# Altium schematic sheet lw-skit.SchDoc
size A4
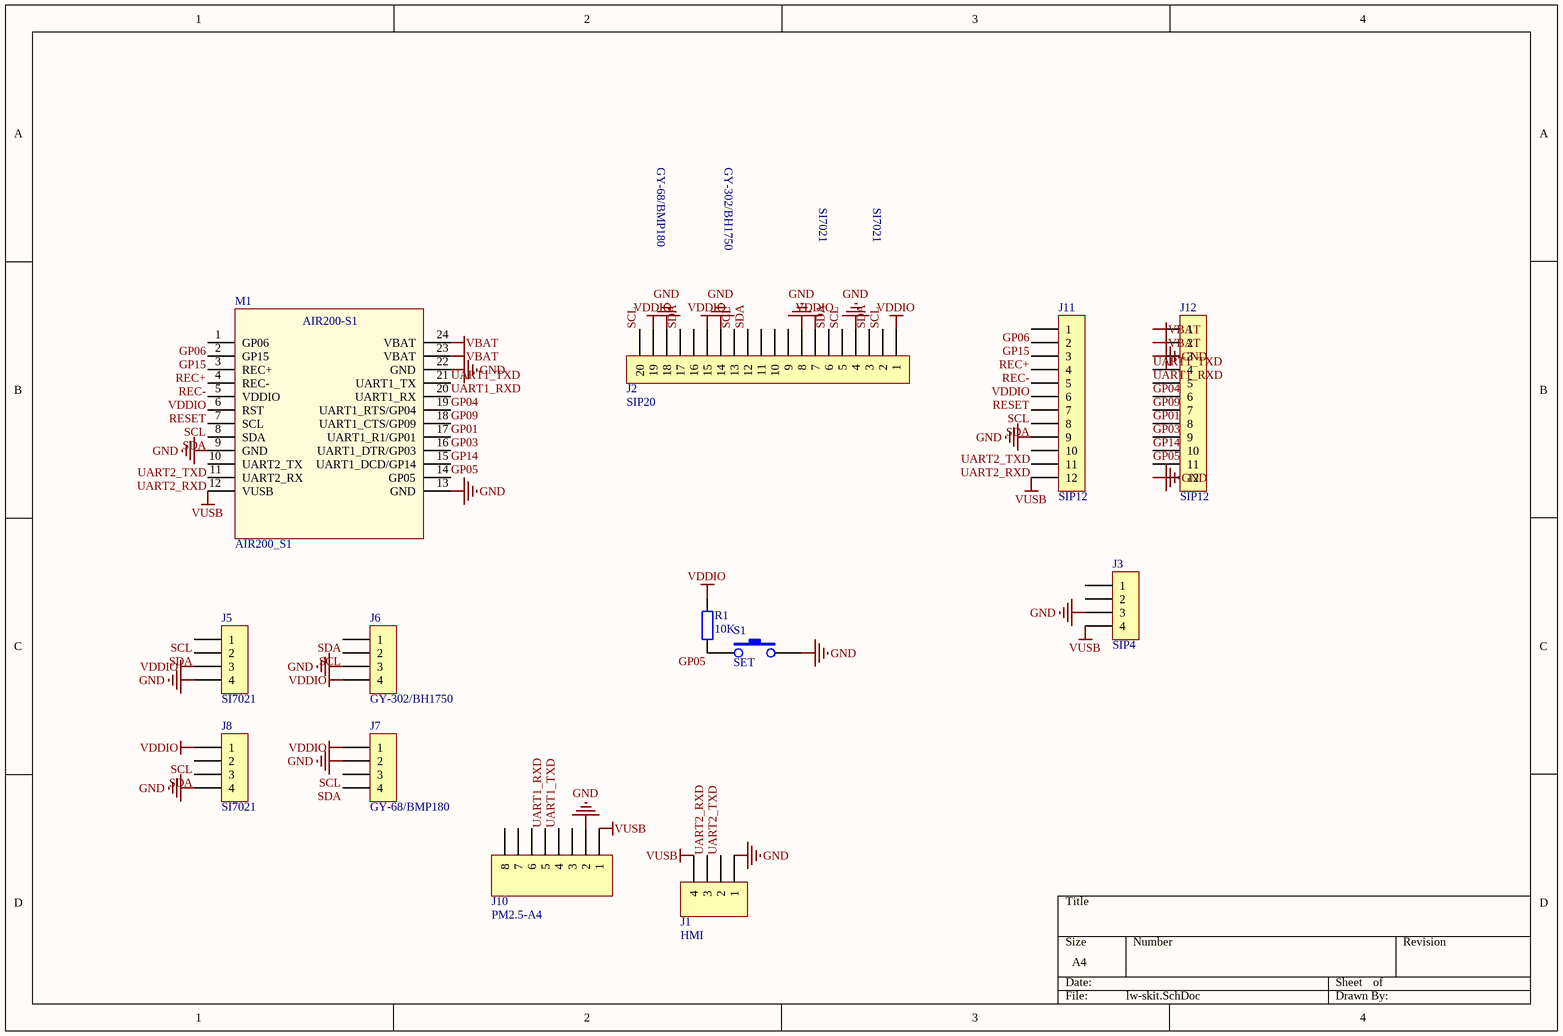
[diagram p0: lw-skit.SchDoc]

## Parts
J1  HMI  [XH2.54_4P]
J2  SIP20  [DB-1X20]
J3  SIP4  [DB-1X4]
J5  SI7021  [DB-1X4]
J6  GY-302/BH1750  [DB-1X4]
J7  GY-68/BMP180  [DB-1X4]
J8  SI7021  [DB-1X4]
J10  PM2.5-A4  [1.27*8]
J11  SIP12  [DB-1X12]
J12  SIP12  [DB-1X12]
M1  AIR200_S1  [AIR200-S1]
R1  10K  [RES-SMD-0603]
S1  SET  [upkey]

## Nets
GND: J1.1 J2.4 J2.8 J2.14 J2.18 J3.3 J5.4 J6.3 J7.2 J8.4 J10.2 J11.9 J12.3 J12.12 M1.9(GND) M1.13(GND) M1.22(GND) S1.2
VBAT: J12.1 J12.2 M1.23(VBAT) M1.24(VBAT)
VDDIO: J2.1 J2.7 J2.15 J2.19 J5.3 J6.4 J7.1 J8.1 J11.5 M1.5(VDDIO) R1.2
VUSB: J1.4 J3.4 J10.1 J11.12 M1.12(VUSB)
GP01: J12.8 M1.17(UART1_R1/GP01)
GP03: J12.9 M1.16(UART1_DTR/GP03)
GP04: J12.6 M1.19(UART1_RTS/GP04)
GP05: J12.11 M1.14(GP05) R1.1 S1.1
GP06: J11.1 M1.1(GP06)
GP09: J12.7 M1.18(UART1_CTS/GP09)
GP14: J12.10 M1.15(UART1_DCD/GP14)
GP15: J11.2 M1.2(GP15)
REC+: J11.3 M1.3(REC+)
REC-: J11.4 M1.4(REC-)
RESET: J11.6 M1.6(RST)
SCL: J2.2 J2.5 J2.13 J2.20 J5.1 J6.2 J7.3 J8.2 J11.7 M1.7(SCL)
SDA: J2.3 J2.6 J2.12 J2.17 J5.2 J6.1 J7.4 J8.3 J11.8 M1.8(SDA)
UART1_RXD: J10.5 J12.5 M1.20(UART1_RX)
UART1_TXD: J10.4 J12.4 M1.21(UART1_TX)
UART2_RXD: J1.3 J11.11 M1.11(UART2_RX)
UART2_TXD: J1.2 J11.10 M1.10(UART2_TX)

Not connected (* = marked no-connect by the designer): J2 9 10 11 16; J3 1 2; J10 3 6 7 8

## Notes on the sheet
- GY-68/BMP180
- GY-302/BH1750
- SI7021
- (in symbol AIR200_S1) AIR200-S1

## Library data of the parts
J1 = XH2.54-4P
J5-J8 = SIP4
J10 = FPC-1.27-8P
R1 = Res0603
S1 = SW_KEY_L: 按键开关立式